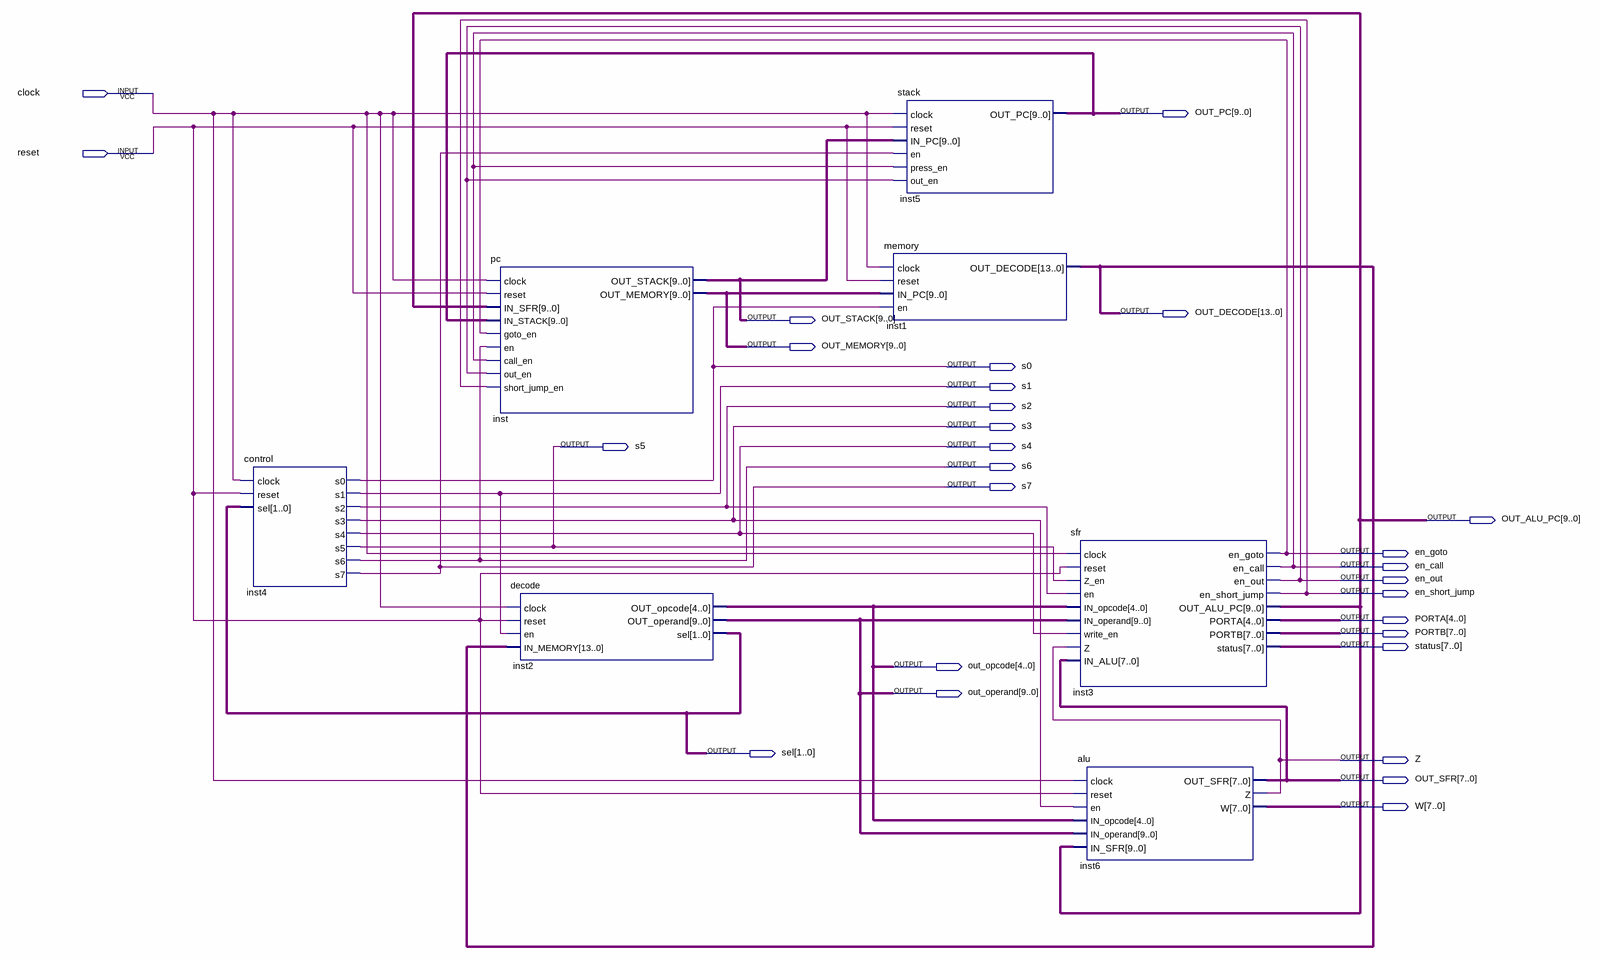
[diagram p0: schematic sheet]
// Quartus schematic top.bdf as structural Verilog: 7 symbols, 28 pins
module top (
  input  clock,
  input  reset,
  output [9:0] OUT_PC,
  output [13:0] OUT_DECODE,
  output [9:0] OUT_STACK,
  output [9:0] OUT_MEMORY,
  output s0,
  output s1,
  output s2,
  output s3,
  output s5,
  output s4,
  output s6,
  output s7,
  output [9:0] OUT_ALU_PC,
  output en_goto,
  output en_call,
  output en_out,
  output en_short_jump,
  output [4:0] PORTA,
  output [7:0] PORTB,
  output [7:0] status,
  output [4:0] out_opcode,
  output [9:0] out_operand,
  output [1:0] sel,
  output Z,
  output [7:0] OUT_SFR,
  output [7:0] W
);

  control inst4 (
    .clock(clock), .reset(reset), .sel(sel), .s0(s0), .s1(s1), .s2(s2), .s3(s3), .s4(s4), .s5(s5), .s6(s6),
    .s7(s7));
  pc inst (
    .clock(clock), .reset(reset), .IN_SFR(OUT_ALU_PC), .IN_STACK(OUT_PC), .goto_en(en_goto), .en(s6),
    .call_en(en_call), .out_en(en_out), .short_jump_en(en_short_jump), .OUT_STACK(OUT_STACK),
    .OUT_MEMORY(OUT_MEMORY));
  decode inst2 (
    .clock(clock), .reset(reset), .en(s1), .IN_MEMORY(OUT_DECODE), .OUT_opcode(out_opcode),
    .OUT_operand(out_operand), .sel(sel));
  stack inst5 (
    .clock(clock), .reset(reset), .IN_PC(OUT_STACK), .en(s7), .press_en(en_call), .out_en(en_out),
    .OUT_PC(OUT_PC));
  memory inst1 (.clock(clock), .reset(reset), .IN_PC(OUT_MEMORY), .en(s0), .OUT_DECODE(OUT_DECODE));
  sfr inst3 (
    .clock(clock), .reset(reset), .Z_en(s5), .en(s2), .IN_opcode(out_opcode), .IN_operand(out_operand),
    .write_en(s4), .Z(Z), .IN_ALU(OUT_SFR), .en_goto(en_goto), .en_call(en_call), .en_out(en_out),
    .en_short_jump(en_short_jump), .OUT_ALU_PC(OUT_ALU_PC), .PORTA(PORTA), .PORTB(PORTB), .status(status));
  alu inst6 (
    .clock(clock), .reset(reset), .en(s3), .IN_opcode(out_opcode), .IN_operand(out_operand),
    .IN_SFR(OUT_ALU_PC), .OUT_SFR(OUT_SFR), .Z(Z), .W(W));
endmodule
